# Altium project PCB_Project.PrjPcb
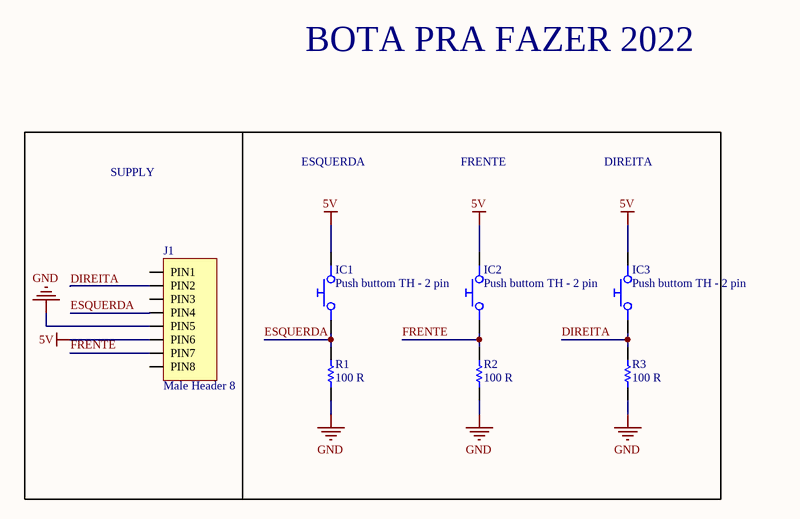
[diagram p0: Sheet1.SchDoc]
1 sheet, 7 parts. Net scope: global (net labels, ports and power ports of the same name join across sheets).
Board file: PCB1.PcbDoc

## Sheet Sheet1.SchDoc
size A4; SheetNumber: 1; SheetTotal: 1

### Parts
IC1  Push buttom TH - 2 pin  [BUTTON - TH - 2PIN]
IC2  Push buttom TH - 2 pin  [BUTTON - TH - 2PIN]
IC3  Push buttom TH - 2 pin  [BUTTON - TH - 2PIN]
J1  Male Header 8  [MALE HEADER 8]
R1  100 R  [RESISTOR_THROUGH_HOLE]
R2  100 R  [RESISTOR_THROUGH_HOLE]
R3  100 R  [RESISTOR_THROUGH_HOLE]

### Nets
5V: IC1.2 IC2.2 IC3.2 J1.PIN6
GND: J1.PIN5 R1.1 R2.1 R3.1
DIREITA: IC3.1 J1.PIN2 R3.2
ESQUERDA: IC1.1 J1.PIN4 R1.2
FRENTE: IC2.1 J1.PIN7 R2.2

Not connected (* = marked no-connect by the designer): J1 PIN1 PIN3 PIN8

### Notes on the sheet
- BOTA PRA FAZER 2022
- SUPPLY
- ESQUERDA
- FRENTE
- DIREITA

### Library data of the parts
IC1-IC3 = Push buttom TH - 2 pin: Push buttom true hole with 2 pin; Manufacturer_Name: CUI Inc.; Manufacturer_Part_Number: TS02-66-90-BK-100-SCR-D; Height: 9.2mm; ComponentLink1Description: Datasheet; ComponentLink1URL: https://www.gravitech.us/mipubusw2qt4.html
J1 = Male Header 8: Number of Contacts: 8; Library Control - Person that did the Last Update Schematic: Marcos; System: Connector; Library Ref: Header; Library Control - Checked Footprint: *; Library Control - Checked Schematic: *; Library Control - Last Project that Used: *; Library Control - Last Update: *; Library Control - Person that Checked Footprint: *; Library Control - Person that Checked Schematic: *; Library Control - Persont that did the Last Update Footprint: Marcos
R1-R3 = PR03000201000JAC00: RES PTH 100 OHM 5% 3W; Manufacturer: Vishay / BC Components; Temperature Coefficient: 250 PPM / C; Voltage Rating: 750 V; Library Control - Checked Footprint: Yes; Library Control - Person that Checked Footprint: Nikaum; Supplier 1: Mouser; Part Number: PR03000201000JAC00; Category: Metal Film Resistors - Through Hole; Price: 1 = 0,53, 100 = 0,286 (USD); Package / Case: Ammo Pack; Operating Temperature: - 55°C ~ 155°C; Value: 100 R; Tolerance: 5 %; Power Rating: 3 W; Library Ref: Resistor; Resistor Type: Fixed; Size / Dimension: 5,20 D x 16,70 L x 0,78 LD; Supplier Part Number 1: 594-5093NW100R0J; Library Control - Checked Schematic: Yes; Library Control - Last Update: 27/06/2021 20:43; Library Control - Person that Checked Schematic: Nikaum; Library Control - Person that did the Last Update Footprint: Nikaum; Library Control - Person that did the Last Update Schematic: Nikaum; ComponentLink1Description: Mouser Link; ComponentLink1URL: https://br.mouser.com/ProductDetail/Vishay-BC-Components/PR03000201000JAC00/?qs=HbLW8Yl3MFzoQdcSX5YM3A%3D%3D; ComponentLink2Description: Datasheet; ComponentLink2URL: https://br.mouser.com/datasheet/2/427/pr010203-1762580.pdf